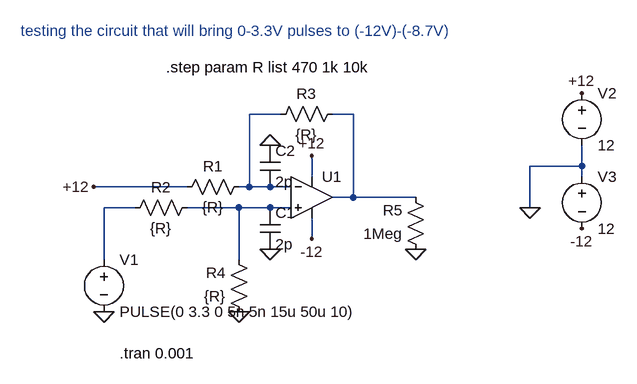
[diagram p0: schematic Voltage_Subtractor_for_negative_pulses.asc]
Voltage_Subtractor_for_negative_pulses.asc, the LTspice schematic file:
Version 4
SHEET 1 880 680
WIRE 304 192 256 192
WIRE 416 192 384 192
WIRE 768 272 768 240
WIRE 768 272 688 272
WIRE 352 288 352 256
WIRE 768 288 768 272
WIRE 160 304 16 304
WIRE 256 304 256 192
WIRE 256 304 240 304
WIRE 288 304 256 304
WIRE 320 304 288 304
WIRE 416 320 416 192
WIRE 416 320 384 320
WIRE 512 320 416 320
WIRE 80 336 32 336
WIRE 240 336 160 336
WIRE 288 336 240 336
WIRE 320 336 288 336
WIRE 688 336 688 272
WIRE 352 384 352 352
WIRE 32 416 32 336
WIRE 240 416 240 336
FLAG 32 496 0
FLAG 240 496 0
FLAG 688 336 0
FLAG 352 256 +12
FLAG 768 160 +12
FLAG 352 384 -12
FLAG 768 368 -12
FLAG 16 304 +12
FLAG 512 400 0
FLAG 288 400 0
FLAG 288 240 0
SYMBOL voltage 32 400 R0
SYMATTR InstName V1
SYMATTR Value PULSE(0 3.3 0 5n 5n 15u 50u 10)
SYMBOL voltage 768 144 R0
SYMATTR InstName V2
SYMATTR Value 12
SYMBOL voltage 768 272 R0
SYMATTR InstName V3
SYMATTR Value 12
SYMBOL OpAmps/UniversalOpAmp2 352 320 R0
SYMATTR InstName U1
SYMBOL res 256 288 R90
WINDOW 0 0 56 VBottom 2
WINDOW 3 32 56 VTop 2
SYMATTR InstName R1
SYMATTR Value {R}
SYMBOL res 176 320 R90
WINDOW 0 0 56 VBottom 2
WINDOW 3 32 56 VTop 2
SYMATTR InstName R2
SYMATTR Value {R}
SYMBOL res 400 176 R90
WINDOW 0 0 56 VBottom 2
WINDOW 3 32 56 VTop 2
SYMATTR InstName R3
SYMATTR Value {R}
SYMBOL res 256 512 R180
WINDOW 0 36 76 Left 2
WINDOW 3 36 40 Left 2
SYMATTR InstName R4
SYMATTR Value {R}
SYMBOL res 528 416 R180
WINDOW 0 36 76 Left 2
WINDOW 3 36 40 Left 2
SYMATTR InstName R5
SYMATTR Value 1Meg
SYMBOL cap 272 336 R0
SYMATTR InstName C1
SYMATTR Value 2p
SYMBOL cap 272 240 R0
SYMATTR InstName C2
SYMATTR Value 2p
TEXT 56 560 Left 2 !.tran 0.001
TEXT 128 120 Left 2 !.step param R list 470 1k 10k
TEXT -96 64 Left 2 ;testing the circuit that will bring 0-3.3V pulses to (-12V)-(-8.7V)

The netlist it stands for:
* Voltage_Subtractor_for_negative_pulses.asc
V1 N003 0 PULSE(0 3.3 0 5n 5n 15u 50u 10)
V2 +12 0 12
V3 0 -12 12
XU1 N004 N001 +12 -12 N002 level2 Avol=1Meg GBW=10Meg Slew=10Meg Ilimit=25m Rail=0 Vos=0 En=0 Enk=0 In=0 Ink=0 Rin=500Meg  ; pins In+ In- V+ V- OUT
R1 N001 +12 {R}
R2 N004 N003 {R}
R3 N002 N001 {R}
R4 0 N004 {R}
R5 0 N002 1Meg
C1 N004 0 2p
C2 0 N001 2p
.tran 0.001
.step param R list 470 1k 10k
* testing the circuit that will bring 0-3.3V pulses to (-12V)-(-8.7V)
.lib UniversalOpAmp2.lib
.backanno
.end